# Altium project EK2_SMPS_Alitum.PrjPcb
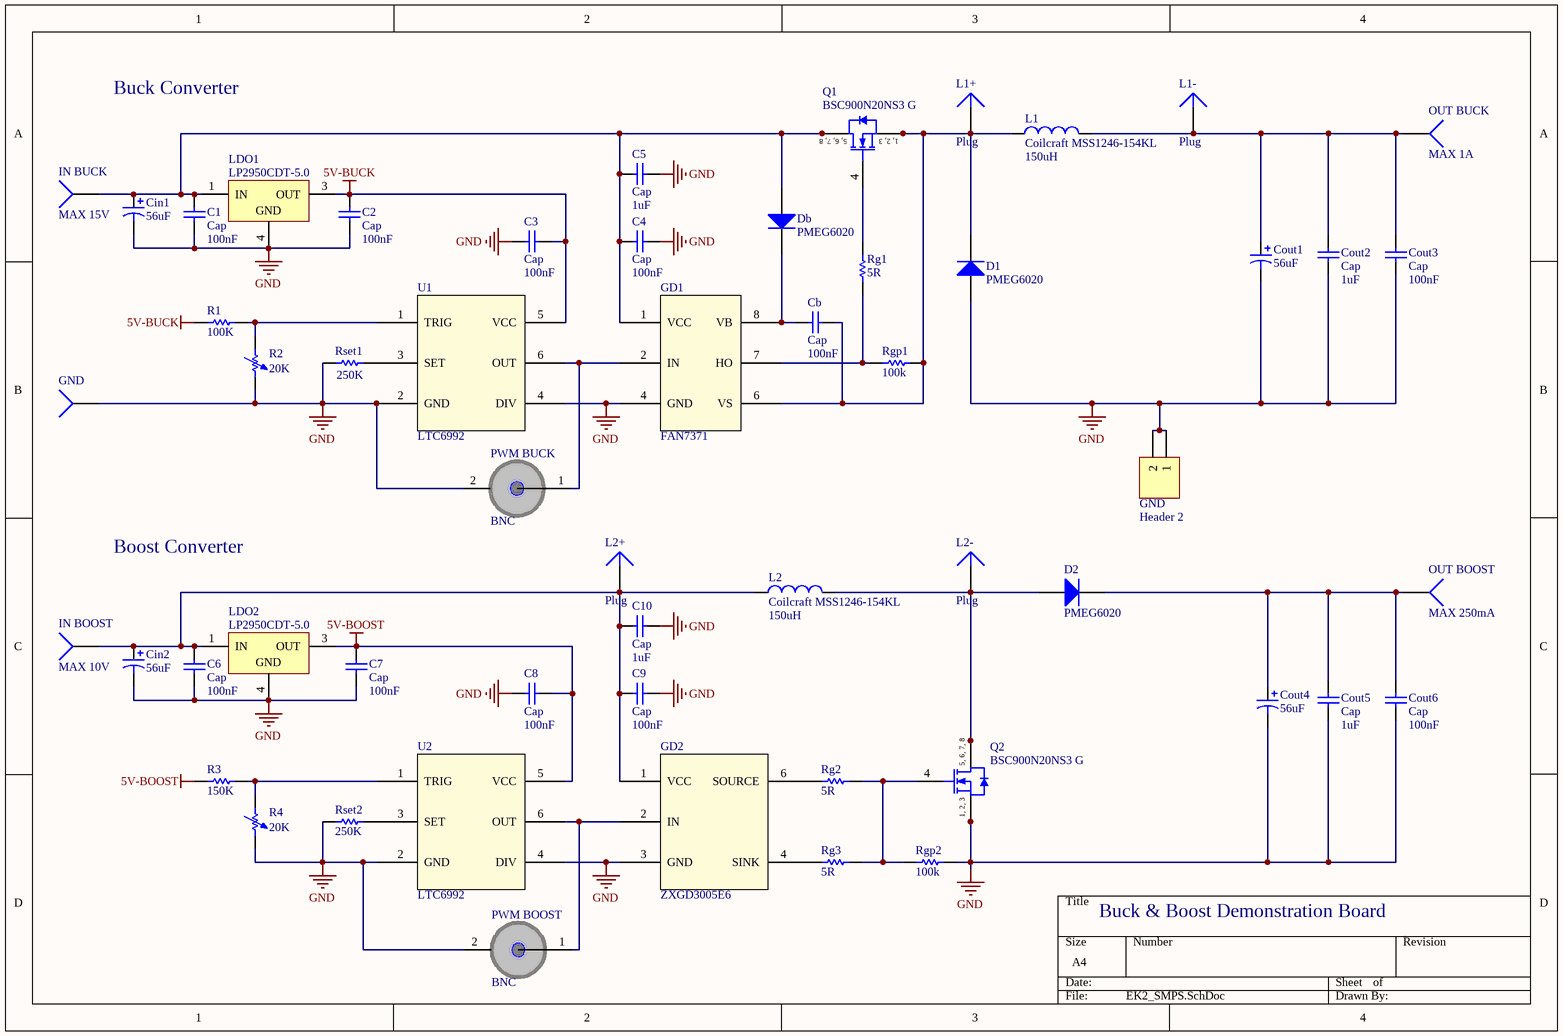
[diagram p0: EK2_SMPS.SchDoc]
1 sheet, 55 parts. Net scope: global (net labels, ports and power ports of the same name join across sheets).
Board file: EK2_SMPS.PcbDoc

## Sheet EK2_SMPS.SchDoc: Buck & Boost Demonstration Board
size A4; Date: 30/1/2018

### Parts
(Parts that share a designator on the sheet are numbered #1, #2 ... from top to bottom, then left to right.)
C1  Cap  value 100nF  [6-0805_L]
C2  Cap  value 100nF  [6-0805_L]
C3  Cap  value 100nF  [6-0805_L]
C4  Cap  value 100nF  [6-0805_L]
C5  Cap  value 1uF  [6-0805_L]
C6  Cap  value 100nF  [6-0805_L]
C7  Cap  value 100nF  [6-0805_L]
C8  Cap  value 100nF  [6-0805_L]
C9  Cap  value 100nF  [6-0805_L]
C10  Cap  value 1uF  [6-0805_L]
Cb  Cap  value 100nF  [6-0805_L]
Cin1  56uF  [Panasonic56]
Cin2  56uF  [Panasonic56]
Cout1  56uF  [Panasonic56]
Cout2  Cap  value 1uF  [6-0805_L]
Cout3  Cap  value 100nF  [6-0805_L]
Cout4  56uF  [Panasonic56]
Cout5  Cap  value 1uF  [6-0805_L]
Cout6  Cap  value 100nF  [6-0805_L]
D1  PMEG6020  [PMEG6020]
D2  PMEG6020  [PMEG6020]
Db  PMEG6020  [PMEG6020]
GD1  FAN7371  [FAN7371]
GD2  ZXGD3005E6  [ZXGD3005E6 (Diodes Inc)]
GND#1  Banana Jack Black  [CT2912-0 (black)]  (value not drawn)
GND#2  Header 2  [pin2]
IN_BOOST  MAX 10V  [CT2912-2 (red)]
IN_BUCK  MAX 15V  [CT2912-2 (red)]
L1  Coilcraft MSS1246-154KL  value 150uH  [Coilcraft MSS1246-154KL]
L1+  Plug  [PIN1]
L1-  Plug  [PIN1]
L2  Coilcraft MSS1246-154KL  value 150uH  [Coilcraft MSS1246-154KL]
L2+  Plug  [PIN1]
L2-  Plug  [PIN1]
LDO1  LP2950CDT-5.0  [TD03B_L]
LDO2  LP2950CDT-5.0  [TD03B_L]
OUT_BOOST  MAX 250mA  [CT2912-2 (red)]
OUT_BUCK  MAX 1A  [CT2912-2 (red)]
PWM_BOOST  BNC  [BNC]
PWM_BUCK  BNC  [BNC]
Q1  BSC900N20NS3 G  [INF-PG-TDSON-8-1_V]
Q2  BSC900N20NS3 G  [INF-PG-TDSON-8-1_V]
R1  value 100K  [6-0805_L]  (hidden comment: Res1)
R2  value 20K  [Bourns PTV09A-4020]  (hidden comment: DUTY BUCK)
R3  value 150K  [6-0805_L]  (hidden comment: Res1)
R4  value 20K  [Bourns PTV09A-4020]  (hidden comment: DUTY BOOST)
Rg1  value 5R  [6-0805_L]  (hidden comment: Res1)
Rg2  value 5R  [6-0805_L]  (hidden comment: Res1)
Rg3  value 5R  [6-0805_L]  (hidden comment: Res1)
Rgp1  value 100k  [6-0805_L]  (hidden comment: Res1)
Rgp2  value 100k  [6-0805_L]  (hidden comment: Res1)
Rset1  value 250K  [6-0805_L]  (hidden comment: Res1)
Rset2  value 250K  [6-0805_L]  (hidden comment: Res1)
U1  LTC6992  [LTC6992]
U2  LTC6992  [LTC6992]

### Nets
5V-BOOST: C7.2 C8.1 LDO2.3(OUT) R3.2 U2.5(VCC)
5V-BUCK: C2.2 C3.2 LDO1.3(OUT) R1.1 U1.5(VCC)
GND: C1.2 C2.1 C3.1 C4.1 C5.1 C6.1 C7.1 C8.2 C9.2 C10.2 Cin1.2 Cin2.2 Cout1.2 Cout2.1 Cout3.1 Cout4.2 Cout5.1 Cout6.1 D1.1(A) GD1.4(GND) GD2.3(GND) GND#1.1 GND#2.1 GND#2.2 LDO1.4(GND) LDO2.4(GND) PWM_BOOST.2(gnd) PWM_BUCK.2(gnd) Q2.1(SOURCE) Q2.2(SOURCE) Q2.3(SOURCE) R2.2 R4.2 Rgp2.1 Rset1.1 Rset2.1 U1.2(GND) U1.4(DIV) U2.2(GND) U2.4(DIV)
NetC1_1: C1.1 C4.2 C5.2 Cin1.1 Db.1(A) GD1.1(VCC) IN_BUCK.1 LDO1.1(IN) Q1.5(DRAIN) Q1.6(DRAIN) Q1.7(DRAIN) Q1.8(DRAIN)
NetC6_2: C6.2 C9.1 C10.1 Cin2.1 GD2.1(VCC) IN_BOOST.1 L2.1 L2+.1 LDO2.1(IN)
NetCb_1: Cb.1 Db.2(K) GD1.8(VB)
NetCb_2: Cb.2 D1.2(K) GD1.6(VS) L1.1 L1+.1 Q1.1(SOURCE) Q1.2(SOURCE) Q1.3(SOURCE) Rgp1.1
NetCout1_1: Cout1.1 Cout2.2 Cout3.2 L1.2 L1-.1 OUT_BUCK.1
NetCout4_1: Cout4.1 Cout5.2 Cout6.2 D2.2(K) OUT_BOOST.1
NetD2_1: D2.1(A) L2.2 L2-.1 Q2.5(DRAIN) Q2.6(DRAIN) Q2.7(DRAIN) Q2.8(DRAIN)
NetGD1_2: GD1.2(IN) PWM_BUCK.1 U1.6(OUT)
NetGD1_7: GD1.7(HO) Rg1.1 Rgp1.2
NetGD2_2: GD2.2(IN) PWM_BOOST.1 U2.6(OUT)
NetGD2_4: GD2.4(SINK) Rg3.1
NetGD2_6: GD2.6(SOURCE) Rg2.1
NetQ1_4: Q1.4(GATE) Rg1.2
NetQ2_4: Q2.4(GATE) Rg2.2 Rg3.2 Rgp2.2
NetR1_2: R1.2 R2.1 U1.1(TRIG)
NetR3_1: R3.1 R4.1 U2.1(TRIG)
NetRset1_2: Rset1.2 U1.3(SET)
NetRset2_2: Rset2.2 U2.3(SET)

### Notes on the sheet
- Buck Converter
- Boost Converter
- (in symbol CMP-1091-00024-1) 5, 6, 7, 8; 1, 2, 3

### Library data of the parts
C1-C10 Cb Cout2 Cout3 Cout5 Cout6 = Cap: Capacitor
Cin1 Cin2 Cout1 Cout4 = Cap Pol1: Polarized Capacitor (Radial)
D1 D2 Db = Diode: Default Diode
GD2 = ZXGD3005E6 (Diodes Inc)
GND#1 = Socket
GND#2 = Header 2: Header, 2-Pin; LatestRevisionDate: 17-Jul-2002; LatestRevisionNote: Re-released for DXP Platform.; Publisher: Altium Limited
IN_BOOST IN_BUCK OUT_BOOST OUT_BUCK = Socket: Banana Jack Red
L1 L2 = Inductor
LDO1 LDO2 = CMP-0062-00257-2: Series of Adjustable Micropower Voltage Regulators, 3-pin TO-252; Manufacturer: National Semiconductor; PackageTopMarking: NSUZXYTT*LP2950*CDT-5.0; CompType: LDO IC; PowerWise: N; PackageDescription: TO252, Molded, Jedec, 6.8 x 6.10 x 2.30mm Body, 3 Lead, 2.28mm Pitch, Surface Mount; PackageReference: TD03B; DatasheetVersion: May-2005; Code_JEDEC: TO-252-AA; PinCount: 3; ComponentLink1Description: LP2950 Datasheet; ComponentLink2Description: LP2950 Web Page; ComponentLink3URL: http://www.national.com/packaging/folders/td03b.html; ComponentLink3Description: TD03B Package Page; RoHS: N; ComponentLink1URL: http://www.national.com/ds/LP/LP2950.pdf; RevisionNote: Component URLs added; ComponentLink2URL: http://www.national.com/pf/LP/LP2950.html; PackageVersion: revD, Feb-2009
Q1 Q2 = CMP-1091-00024-1: N-Channel OptiMOS 3 Power-Transistor, 200 V VDS, 15.2 A ID, -55 to 150 degC, PG-TDSON-8-1, Reel, Green; Manufacturer: Infineon; RDS (on) (max): 90Â mOhm; RthJC (max): 2Â K/W; Green: TRUE; IDpuls (max): 61Â A; VGS(th) (min): 2Â V; RthJA (max): 50 K/W; Polarity: N; QG: 9Â nC; VGS(th) (max): 4Â V; VDS (max): 200Â V; ID (max): 15.2Â A; Ptot (max): 62.5Â W; PackageReference: PG-TDSON-8-1; PackageDescription: 8-Pin Plastic (Green) Thin Dual Small Outline Non-Leaded Package, 5.15 x 5.9 mm Body, 1.27 mm Pitch; ComponentLink2Description: Datasheet; ComponentLink3URL: http://www.infineon.com/cms/packages/SMD_-_Surface_Mounted_Devices/P-PG-TDSON/P-PG-TDSON-08-01x_2x_3.html?__locale=en; ComponentLink1URL: http://www.infineon.com/; PartNumber: BSC900N20NS3 G; Packing: Reel; DatasheetVersion: Rev. 2.2; Mounting Technology: Surface Mount; ComponentLink3Description: Package Specification; ComponentLink2URL: http://www.infineon.com/dgdl/BSC900N20NS3+Rev2.2.pdf?folderId=db3a304325305e6d012596c6ca7b290a&fileId=db3a30432ad629a6012b144f6b0619db; Rth: 2Â K/W; ComponentLink1Description: Manufacturer URL; Halogen-free: TRUE
R1 R3 Rg1-Rg3 Rgp1 Rgp2 Rset1 Rset2 = Res1: Resistor
R2 R4 = Res Adj1: Variable Resistor
U1 U2 = LTC6992: LTC6992 PWM generator
L1+ L1- L2+ L2- = Plug: LatestRevisionDate: 17-Jul-2002; LatestRevisionNote: Re-released for DXP Platform.; Publisher: Altium Limited